# EAGLE schematic rel-ram-4x8K (EAGLE 9.1.3)
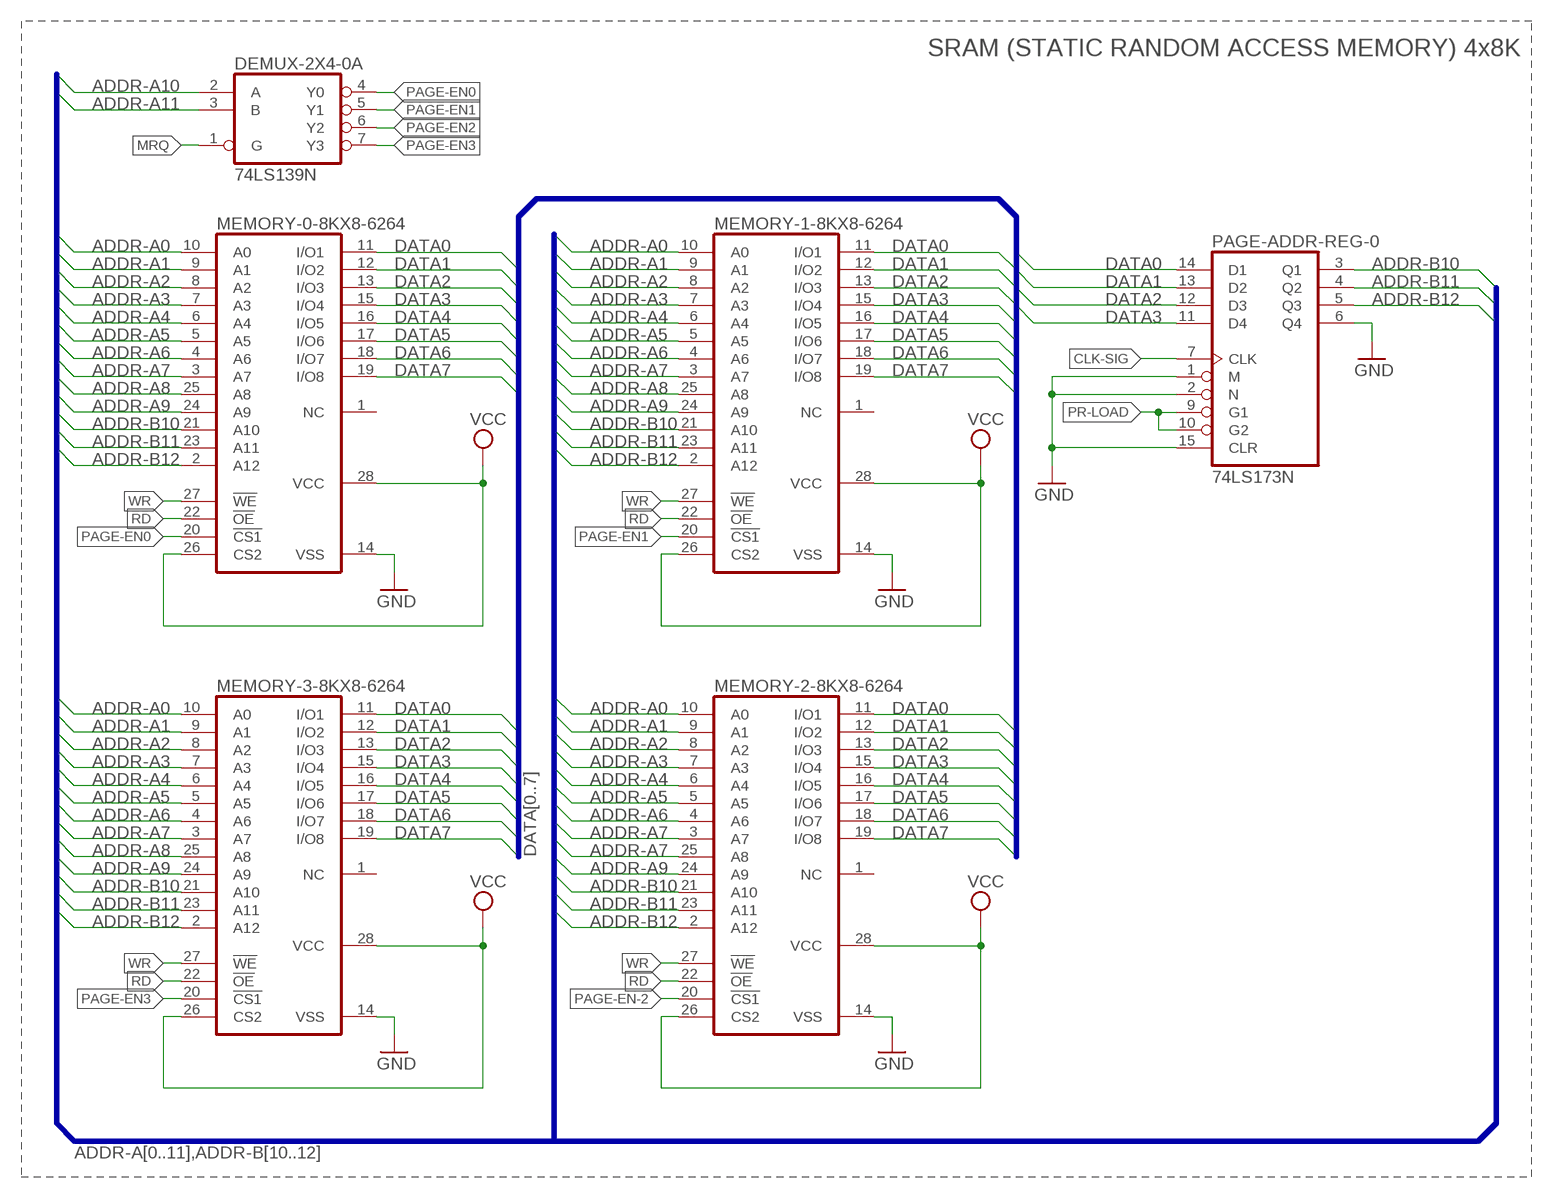
[diagram p0: schematic, sheet 1]

## Parts
DEMUX-2X4-0  74LS139N  [DIL16]
MEMORY-0-8KX8-6264  6264A  [DIL28-6]
MEMORY-1-8KX8-6264  6264A  [DIL28-6]
MEMORY-2-8KX8-6264  6264A  [DIL28-6]
MEMORY-3-8KX8-6264  6264A  [DIL28-6]
PAGE-ADDR-REG-0  74LS173N  [DIL16]

## Nets
ADDR-A0: MEMORY-0-8KX8-6264.10(A0) MEMORY-1-8KX8-6264.10(A0) MEMORY-2-8KX8-6264.10(A0) MEMORY-3-8KX8-6264.10(A0)
ADDR-A1: MEMORY-0-8KX8-6264.9(A1) MEMORY-1-8KX8-6264.9(A1) MEMORY-2-8KX8-6264.9(A1) MEMORY-3-8KX8-6264.9(A1)
ADDR-A2: MEMORY-0-8KX8-6264.8(A2) MEMORY-1-8KX8-6264.8(A2) MEMORY-2-8KX8-6264.8(A2) MEMORY-3-8KX8-6264.8(A2)
ADDR-A3: MEMORY-0-8KX8-6264.7(A3) MEMORY-1-8KX8-6264.7(A3) MEMORY-2-8KX8-6264.7(A3) MEMORY-3-8KX8-6264.7(A3)
ADDR-A4: MEMORY-0-8KX8-6264.6(A4) MEMORY-1-8KX8-6264.6(A4) MEMORY-2-8KX8-6264.6(A4) MEMORY-3-8KX8-6264.6(A4)
ADDR-A5: MEMORY-0-8KX8-6264.5(A5) MEMORY-1-8KX8-6264.5(A5) MEMORY-2-8KX8-6264.5(A5) MEMORY-3-8KX8-6264.5(A5)
ADDR-A6: MEMORY-0-8KX8-6264.4(A6) MEMORY-1-8KX8-6264.4(A6) MEMORY-2-8KX8-6264.4(A6) MEMORY-3-8KX8-6264.4(A6)
ADDR-A7: MEMORY-0-8KX8-6264.3(A7) MEMORY-1-8KX8-6264.3(A7) MEMORY-2-8KX8-6264.3(A7) MEMORY-2-8KX8-6264.25(A8) MEMORY-3-8KX8-6264.3(A7)
ADDR-A8: MEMORY-0-8KX8-6264.25(A8) MEMORY-1-8KX8-6264.25(A8) MEMORY-3-8KX8-6264.25(A8)
ADDR-A9: MEMORY-0-8KX8-6264.24(A9) MEMORY-1-8KX8-6264.24(A9) MEMORY-2-8KX8-6264.24(A9) MEMORY-3-8KX8-6264.24(A9)
ADDR-A10: DEMUX-2X4-0.2(A:A)
ADDR-A11: DEMUX-2X4-0.3(A:B)
ADDR-B10: MEMORY-0-8KX8-6264.21(A10) MEMORY-1-8KX8-6264.21(A10) MEMORY-2-8KX8-6264.21(A10) MEMORY-3-8KX8-6264.21(A10) PAGE-ADDR-REG-0.3(Q1)
ADDR-B11: MEMORY-0-8KX8-6264.23(A11) MEMORY-1-8KX8-6264.23(A11) MEMORY-2-8KX8-6264.23(A11) MEMORY-3-8KX8-6264.23(A11) PAGE-ADDR-REG-0.4(Q2)
ADDR-B12: MEMORY-0-8KX8-6264.2(A12) MEMORY-1-8KX8-6264.2(A12) MEMORY-2-8KX8-6264.2(A12) MEMORY-3-8KX8-6264.2(A12) PAGE-ADDR-REG-0.5(Q3)
CLK-SIG: PAGE-ADDR-REG-0.7(CLK)
DATA0: MEMORY-0-8KX8-6264.11(I/O1) MEMORY-1-8KX8-6264.11(I/O1) MEMORY-2-8KX8-6264.11(I/O1) MEMORY-3-8KX8-6264.11(I/O1) PAGE-ADDR-REG-0.14(D1)
DATA1: MEMORY-0-8KX8-6264.12(I/O2) MEMORY-1-8KX8-6264.12(I/O2) MEMORY-2-8KX8-6264.12(I/O2) MEMORY-3-8KX8-6264.12(I/O2) PAGE-ADDR-REG-0.13(D2)
DATA2: MEMORY-0-8KX8-6264.13(I/O3) MEMORY-1-8KX8-6264.13(I/O3) MEMORY-2-8KX8-6264.13(I/O3) MEMORY-3-8KX8-6264.13(I/O3) PAGE-ADDR-REG-0.12(D3)
DATA3: MEMORY-0-8KX8-6264.15(I/O4) MEMORY-1-8KX8-6264.15(I/O4) MEMORY-2-8KX8-6264.15(I/O4) MEMORY-3-8KX8-6264.15(I/O4) PAGE-ADDR-REG-0.11(D4)
DATA4: MEMORY-0-8KX8-6264.16(I/O5) MEMORY-1-8KX8-6264.16(I/O5) MEMORY-2-8KX8-6264.16(I/O5) MEMORY-3-8KX8-6264.16(I/O5)
DATA5: MEMORY-0-8KX8-6264.17(I/O6) MEMORY-1-8KX8-6264.17(I/O6) MEMORY-2-8KX8-6264.17(I/O6) MEMORY-3-8KX8-6264.17(I/O6)
DATA6: MEMORY-0-8KX8-6264.18(I/O7) MEMORY-1-8KX8-6264.18(I/O7) MEMORY-2-8KX8-6264.18(I/O7) MEMORY-3-8KX8-6264.18(I/O7)
DATA7: MEMORY-0-8KX8-6264.19(I/O8) MEMORY-1-8KX8-6264.19(I/O8) MEMORY-2-8KX8-6264.19(I/O8) MEMORY-3-8KX8-6264.19(I/O8)
GND: MEMORY-0-8KX8-6264.14(VSS) MEMORY-1-8KX8-6264.14(VSS) MEMORY-2-8KX8-6264.14(VSS) MEMORY-3-8KX8-6264.14(VSS) PAGE-ADDR-REG-0.1(M) PAGE-ADDR-REG-0.2(N) PAGE-ADDR-REG-0.6(Q4) PAGE-ADDR-REG-0.15(CLR)
MRQ: DEMUX-2X4-0.1(A:G)
PAGE-EN0: DEMUX-2X4-0.4(A:Y0) MEMORY-0-8KX8-6264.20(!CS1)
PAGE-EN1: DEMUX-2X4-0.5(A:Y1) MEMORY-1-8KX8-6264.20(!CS1)
PAGE-EN2: DEMUX-2X4-0.6(A:Y2)
PAGE-EN3: DEMUX-2X4-0.7(A:Y3) MEMORY-3-8KX8-6264.20(!CS1)
PAGE-EN-2: MEMORY-2-8KX8-6264.20(!CS1)
PR-LOAD: PAGE-ADDR-REG-0.9(G1) PAGE-ADDR-REG-0.10(G2)
RD: MEMORY-0-8KX8-6264.22(!OE) MEMORY-1-8KX8-6264.22(!OE) MEMORY-2-8KX8-6264.22(!OE) MEMORY-3-8KX8-6264.22(!OE)
VCC: MEMORY-0-8KX8-6264.26(CS2) MEMORY-0-8KX8-6264.28(VCC) MEMORY-1-8KX8-6264.26(CS2) MEMORY-1-8KX8-6264.28(VCC) MEMORY-2-8KX8-6264.26(CS2) MEMORY-2-8KX8-6264.28(VCC) MEMORY-3-8KX8-6264.26(CS2) MEMORY-3-8KX8-6264.28(VCC)
WR: MEMORY-0-8KX8-6264.27(!WE) MEMORY-1-8KX8-6264.27(!WE) MEMORY-2-8KX8-6264.27(!WE) MEMORY-3-8KX8-6264.27(!WE)
Unconnected: DEMUX-2X4-0.9(B:Y3) DEMUX-2X4-0.10(B:Y2) DEMUX-2X4-0.11(B:Y1) DEMUX-2X4-0.12(B:Y0) DEMUX-2X4-0.13(B:B) DEMUX-2X4-0.14(B:A) DEMUX-2X4-0.15(B:G) MEMORY-0-8KX8-6264.1(NC) MEMORY-1-8KX8-6264.1(NC) MEMORY-2-8KX8-6264.1(NC) MEMORY-3-8KX8-6264.1(NC)

## Buses
ADDR-A[0..11],ADDR-B[10..12]
DATA[0..7]

## Notes on the sheet
- SRAM (STATIC RANDOM ACCESS MEMORY) 4x8K

## Power pins joined to a net without a drawn wire
GND: DEMUX-2X4-0.8(P:GND) PAGE-ADDR-REG-0.8(GND)
VCC: DEMUX-2X4-0.16(P:VCC) PAGE-ADDR-REG-0.16(VCC)

## Library data of the parts
DEMUX-2X4-0 = 74xx-eu:74*139: Dual 2-line to 4-line DECODER/DEMULTIPLEXER
MEMORY-0-8KX8-6264 MEMORY-1-8KX8-6264 MEMORY-2-8KX8-6264 MEMORY-3-8KX8-6264 = memory-hitachi:6264A: MEMORY; OC_FARNELL: 283605; OC_NEWARK: unknown
PAGE-ADDR-REG-0 = 74xx-eu:74*173: 4-bit D type REGISTER, 3-state